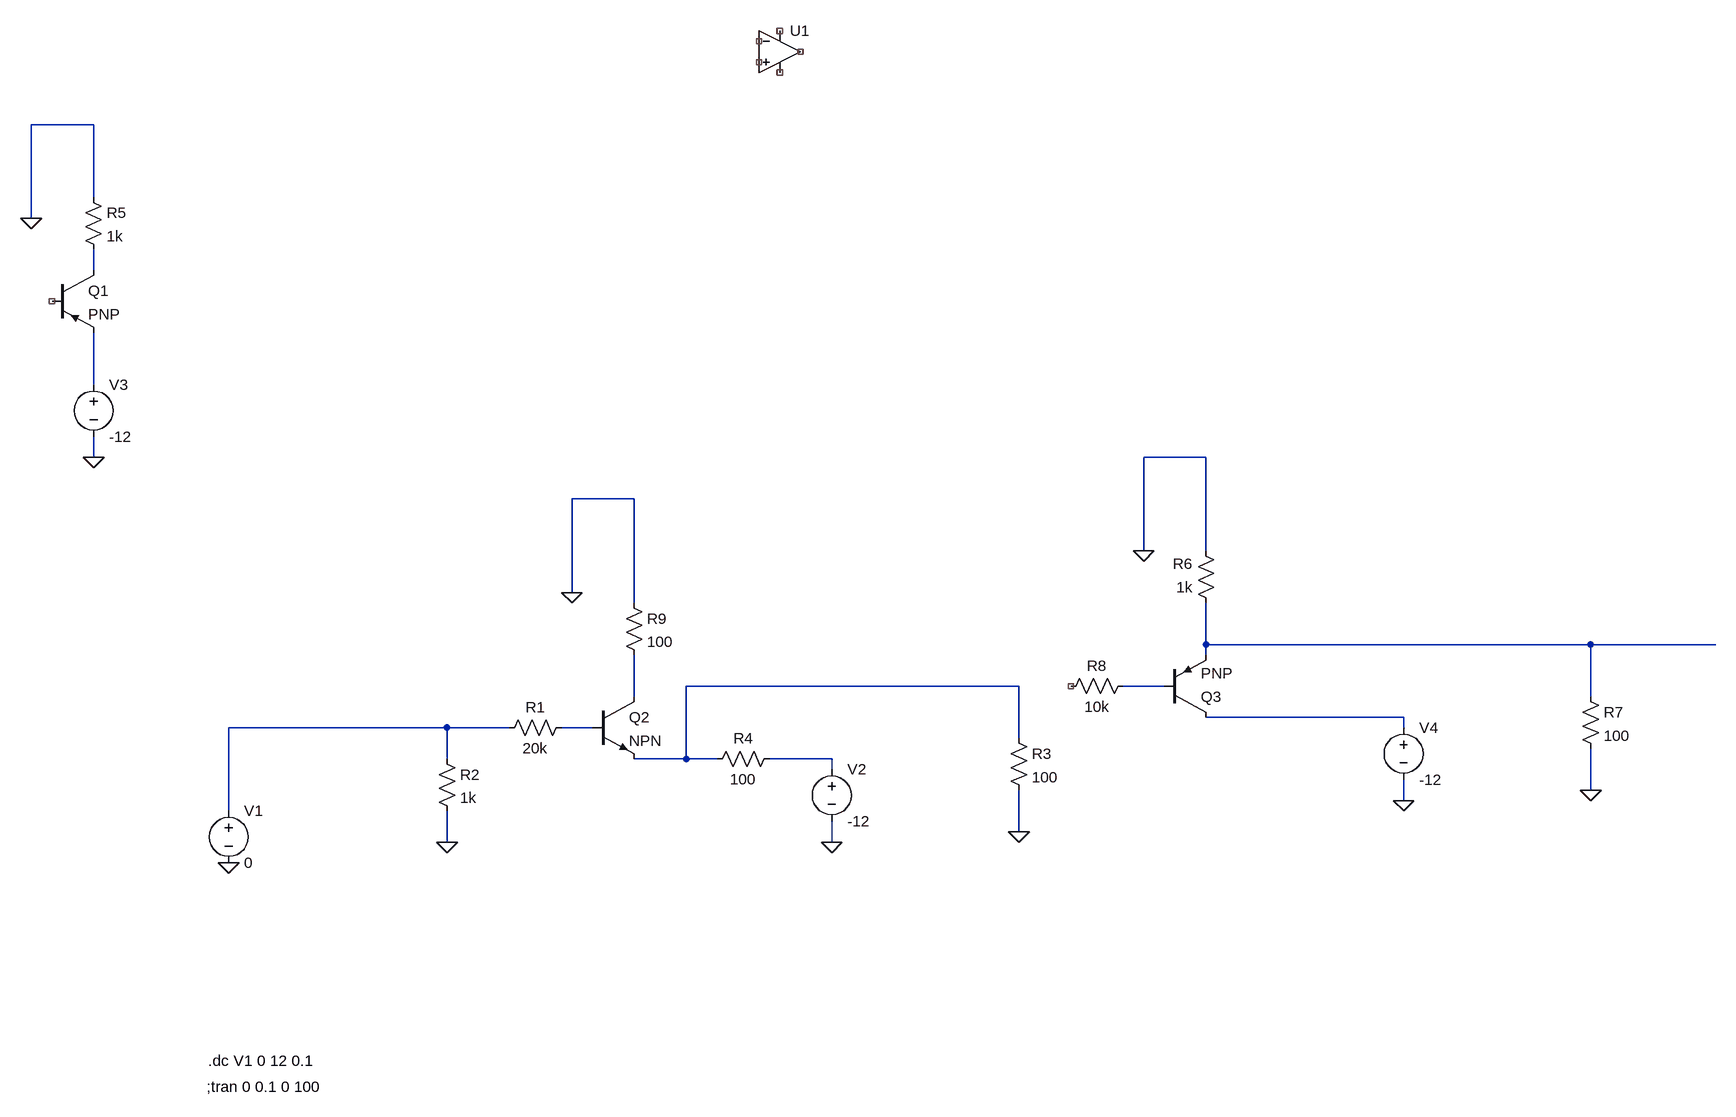
[diagram p0: schematic voltage-move.asc]
voltage-move.asc, the LTspice schematic file:
Version 4
SHEET 1 1940 680
WIRE -560 -1040 -656 -1040
WIRE -560 -928 -560 -1040
WIRE -656 -896 -656 -1040
WIRE -560 -816 -560 -848
WIRE -560 -640 -560 -720
WIRE -560 -528 -560 -560
WIRE 1152 -528 1056 -528
WIRE 272 -464 176 -464
WIRE 1056 -384 1056 -528
WIRE 1152 -384 1152 -528
WIRE 176 -320 176 -464
WIRE 272 -304 272 -464
WIRE 1152 -240 1152 -304
WIRE 1744 -240 1152 -240
WIRE 1936 -240 1744 -240
WIRE 1152 -224 1152 -240
WIRE 864 -176 352 -176
WIRE 1088 -176 1024 -176
WIRE 272 -160 272 -224
WIRE 1744 -160 1744 -240
WIRE 1456 -128 1152 -128
WIRE -16 -112 -352 -112
WIRE 80 -112 -16 -112
WIRE 208 -112 160 -112
WIRE 1456 -112 1456 -128
WIRE 864 -96 864 -176
WIRE -16 -64 -16 -112
WIRE 352 -64 352 -176
WIRE 352 -64 272 -64
WIRE 400 -64 352 -64
WIRE 576 -64 480 -64
WIRE 576 -48 576 -64
WIRE 1744 -16 1744 -80
WIRE 1456 0 1456 -32
WIRE -352 16 -352 -112
WIRE 864 48 864 -16
WIRE -16 64 -16 16
WIRE 576 64 576 32
FLAG -352 96 0
FLAG 176 -320 0
FLAG 576 64 0
FLAG -16 64 0
FLAG 864 48 0
FLAG -560 -528 0
FLAG -656 -896 0
FLAG 1056 -384 0
FLAG 1456 0 0
FLAG 1744 -16 0
SYMBOL voltage -352 0 R0
WINDOW 123 24 124 Left 2
WINDOW 39 0 0 Left 0
SYMATTR InstName V1
SYMATTR Value 0
SYMBOL pnp -624 -816 R0
SYMATTR InstName Q1
SYMBOL res 176 -128 R90
WINDOW 0 0 56 VBottom 2
WINDOW 3 32 56 VTop 2
SYMATTR InstName R1
SYMATTR Value 20k
SYMBOL voltage 576 -64 R0
WINDOW 123 0 0 Left 0
WINDOW 39 0 0 Left 0
SYMATTR InstName V2
SYMATTR Value -12
SYMBOL res 496 -80 R90
WINDOW 0 0 56 VBottom 2
WINDOW 3 32 56 VTop 2
SYMATTR InstName R4
SYMATTR Value 100
SYMBOL npn 208 -160 R0
SYMATTR InstName Q2
SYMBOL res -32 -80 R0
SYMATTR InstName R2
SYMATTR Value 1k
SYMBOL res 848 -112 R0
SYMATTR InstName R3
SYMATTR Value 100
SYMBOL voltage -560 -656 R0
WINDOW 123 0 0 Left 0
WINDOW 39 0 0 Left 0
SYMATTR InstName V3
SYMATTR Value -12
SYMBOL res -576 -944 R0
SYMATTR InstName R5
SYMATTR Value 1k
SYMBOL voltage 1456 -128 R0
WINDOW 123 0 0 Left 0
WINDOW 39 0 0 Left 0
SYMATTR InstName V4
SYMATTR Value -12
SYMBOL res 1168 -288 R180
WINDOW 0 36 76 Left 2
WINDOW 3 36 40 Left 2
SYMATTR InstName R6
SYMATTR Value 1k
SYMBOL res 1728 -176 R0
SYMATTR InstName R7
SYMATTR Value 100
SYMBOL res 1040 -192 R90
WINDOW 0 0 56 VBottom 2
WINDOW 3 32 56 VTop 2
SYMATTR InstName R8
SYMATTR Value 10k
SYMBOL pnp 1088 -128 M180
SYMATTR InstName Q3
SYMBOL res 256 -320 R0
SYMATTR InstName R9
SYMATTR Value 100
SYMBOL OpAmps\\UniversalOpAmp 496 -1152 R0
SYMATTR InstName U1
TEXT -386 440 Left 2 !;tran 0 0.1 0 100
TEXT -384 400 Left 2 !.dc V1 0 12 0.1

The netlist it stands for:
* voltage-move.asc
V1 N008 0 0
Q1 N001 NC_01 N002 0 PNP
R1 N009 N008 20k
V2 N010 0 -12
R4 N010 N004 100
Q2 N006 N009 N004 0 NPN
R2 N008 0 1k
R3 N004 0 100
V3 N002 0 -12
R5 0 N001 1k
V4 N007 0 -12
R6 N003 0 1k
R7 N003 0 100
R8 N005 NC_02 10k
Q3 N007 N005 N003 0 PNP
R9 0 N006 100
XU1 NC_03 NC_04 NC_05 NC_06 NC_07 level1 Avol=1Meg GBW=10Meg Vos=0 En=0 Enk=0 In=0 Ink=0 Rin=500Meg  ; pins In+ In- V+ V- OUT
.model NPN NPN
.model PNP PNP
.lib standard.bjt
;tran 0 0.1 0 100
.dc V1 0 12 0.1
.lib UniversalOpAmp1.lib
.backanno
.end